# Altium project CarteDeFormationGenerique.PrjPCB
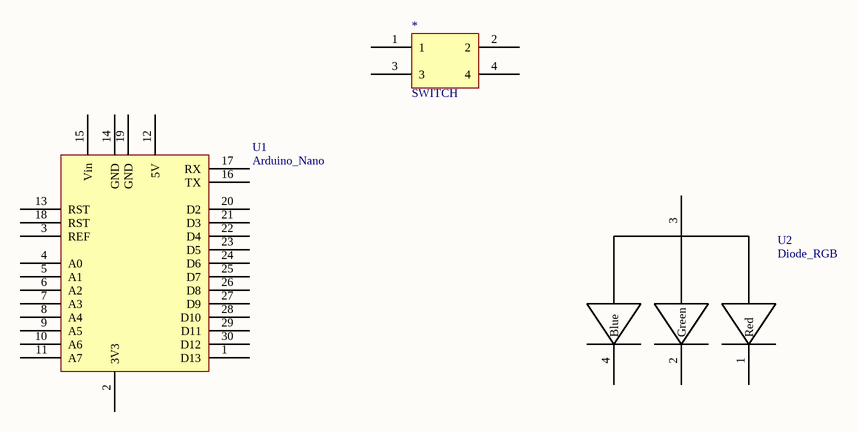
[diagram p0: SchemaCarteGenerique.SchDoc]
1 sheet, 3 parts. Net scope: global (net labels, ports and power ports of the same name join across sheets).
Board file: PCBCarteGenerique.PcbDoc

## Sheet SchemaCarteGenerique.SchDoc
size A

### Parts
*  SWITCH
U1  Arduino_Nano  [Arduino_Nano]
U2  Diode_RGB

### Nets

Not connected (* = marked no-connect by the designer): * 1 2 3 4; U1 1(D13) 2(3V3) 3(REF) 4(A0) 5(A1) 6(A2) 7(A3) 8(A4) 9(A5) 10(A6) 11(A7) 12(5V) 13(RST) 14(GND) 15(Vin) 16(TX) 17(RX) 18(RST) 19(GND) 20(D2) 21(D3) 22(D4) 23(D5) 24(D6) 25(D7) 26(D8) 27(D9) 28(D10) 29(D11) 30(D12); U2 1(Red) 2(Green) 3(Pol) 4(Blue)